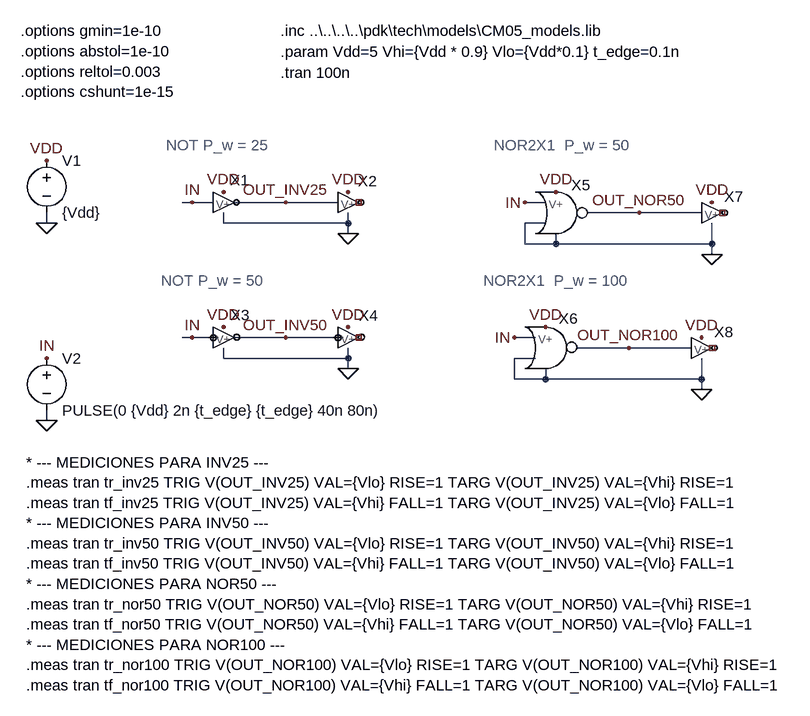
[diagram p0: schematic INFRA_tb.asc]
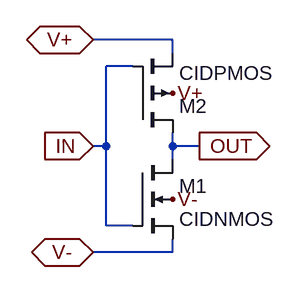
[diagram p1: sub-circuit not.asc]
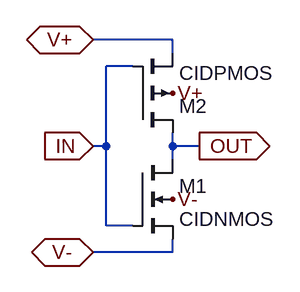
[diagram p2: sub-circuit not_wp_50.asc]
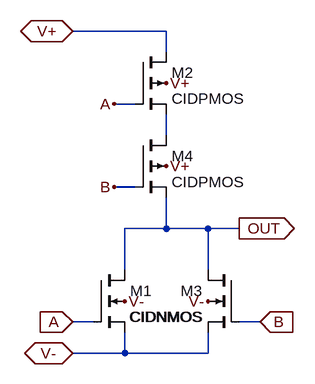
[diagram p3: sub-circuit nor2x1.asc]
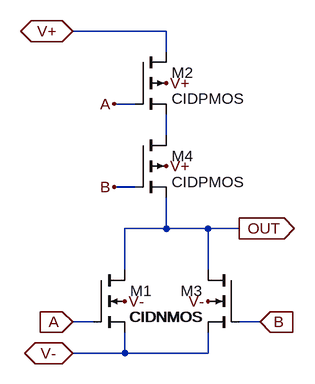
[diagram p4: sub-circuit nor2x1_wp_100.asc]
INFRA_tb.asc, the LTspice schematic file:
Version 4.1
SHEET 1 1208 956
WIRE -48 128 -64 128
WIRE -16 128 -48 128
WIRE 96 128 16 128
WIRE 176 128 96 128
WIRE 496 128 464 128
WIRE 640 144 560 144
WIRE 736 144 640 144
WIRE -272 160 -272 144
WIRE 0 160 0 144
WIRE 192 160 192 144
WIRE 192 160 0 160
WIRE 496 160 464 160
WIRE 192 176 192 160
WIRE 464 192 464 160
WIRE 512 192 512 176
WIRE 512 192 464 192
WIRE 752 192 752 160
WIRE 752 192 512 192
WIRE 752 208 752 192
WIRE -48 336 -64 336
WIRE -16 336 -48 336
WIRE 96 336 16 336
WIRE 176 336 96 336
WIRE 480 336 448 336
WIRE 624 352 544 352
WIRE 720 352 624 352
WIRE 0 368 0 352
WIRE 192 368 192 352
WIRE 192 368 0 368
WIRE 480 368 448 368
WIRE 192 384 192 368
WIRE 448 400 448 368
WIRE 496 400 496 384
WIRE 496 400 448 400
WIRE 736 400 736 368
WIRE 736 400 496 400
WIRE 736 416 736 400
WIRE -272 464 -272 448
FLAG 752 208 0
FLAG 736 416 0
FLAG 192 384 0
FLAG 192 176 0
FLAG 96 128 OUT_INV25
FLAG 96 336 OUT_INV50
FLAG 624 352 OUT_NOR100
FLAG 640 144 OUT_NOR50
FLAG -48 128 IN
FLAG -48 336 IN
FLAG 464 128 IN
FLAG 448 336 IN
FLAG 192 320 VDD
FLAG 0 320 VDD
FLAG 0 112 VDD
FLAG 192 112 VDD
FLAG 512 112 VDD
FLAG 752 128 VDD
FLAG 736 336 VDD
FLAG 496 320 VDD
FLAG -272 64 VDD
FLAG -272 368 IN
FLAG -272 464 0
FLAG -272 160 0
SYMBOL NOT -16 128 R0
WINDOW 0 41 -19 Bottom 2
SYMATTR InstName X1
SYMBOL NOT 176 128 R0
WINDOW 0 46 -17 Bottom 2
SYMATTR InstName X2
SYMBOL NOT_Wp_50 16 368 R0
WINDOW 0 10 -51 Bottom 2
SYMATTR InstName X3
SYMBOL NOT_Wp_50 208 368 R0
WINDOW 0 15 -50 Bottom 2
SYMATTR InstName X4
SYMBOL NOR2X1 512 144 R0
SYMATTR InstName X5
SYMBOL NOR2X1_Wp_100 496 352 R0
WINDOW 0 35 -30 Bottom 2
SYMATTR InstName X6
SYMBOL voltage -272 48 R0
SYMATTR InstName V1
SYMATTR Value {Vdd}
SYMBOL voltage -272 352 R0
SYMATTR InstName V2
SYMATTR Value PULSE(0 {Vdd} 2n {t_edge} {t_edge} 40n 80n)
SYMBOL NOT 736 144 R0
SYMATTR InstName X7
SYMBOL NOT 720 352 R0
SYMATTR InstName X8
TEXT -312 -136 Left 2 !.options gmin=1e-10\n.options abstol=1e-10\n.options reltol=0.003\n.options cshunt=1e-15
TEXT 88 -136 Left 2 !.inc ..\\..\\..\\..\\pdk\\tech\\models\\CM05_models.lib
TEXT -88 40 Left 2 ;NOT P_w = 25
TEXT -96 248 Left 2 ;NOT P_w = 50
TEXT 416 40 Left 2 ;NOR2X1  P_w = 50
TEXT 400 248 Left 2 ;NOR2X1  P_w = 100
TEXT 88 -72 Left 2 !.tran 100n
TEXT 88 -104 Left 2 !.param Vdd=5 Vhi={Vdd * 0.9} Vlo={Vdd*0.1} t_edge=0.1n
TEXT -304 528 Left 2 !* --- MEDICIONES PARA INV25 ---\n.meas tran tr_inv25 TRIG V(OUT_INV25) VAL={Vlo} RISE=1 TARG V(OUT_INV25) VAL={Vhi} RISE=1\n.meas tran tf_inv25 TRIG V(OUT_INV25) VAL={Vhi} FALL=1 TARG V(OUT_INV25) VAL={Vlo} FALL=1\n* --- MEDICIONES PARA INV50 ---\n.meas tran tr_inv50 TRIG V(OUT_INV50) VAL={Vlo} RISE=1 TARG V(OUT_INV50) VAL={Vhi} RISE=1\n.meas tran tf_inv50 TRIG V(OUT_INV50) VAL={Vhi} FALL=1 TARG V(OUT_INV50) VAL={Vlo} FALL=1\n* --- MEDICIONES PARA NOR50 ---\n.meas tran tr_nor50 TRIG V(OUT_NOR50) VAL={Vlo} RISE=1 TARG V(OUT_NOR50) VAL={Vhi} RISE=1\n.meas tran tf_nor50 TRIG V(OUT_NOR50) VAL={Vhi} FALL=1 TARG V(OUT_NOR50) VAL={Vlo} FALL=1\n* --- MEDICIONES PARA NOR100 ---\n.meas tran tr_nor100 TRIG V(OUT_NOR100) VAL={Vlo} RISE=1 TARG V(OUT_NOR100) VAL={Vhi} RISE=1\n.meas tran tf_nor100 TRIG V(OUT_NOR100) VAL={Vhi} FALL=1 TARG V(OUT_NOR100) VAL={Vlo} FALL=1

not.asc, the sub-circuit schematic file:
Version 4.1
SHEET 1 880 680
WIRE 256 16 160 16
WIRE 256 32 256 16
WIRE 208 48 176 48
WIRE 176 144 176 48
WIRE 176 144 160 144
WIRE 256 144 256 128
WIRE 288 144 256 144
WIRE 256 160 256 144
WIRE 176 240 176 144
WIRE 208 240 176 240
WIRE 256 272 256 256
WIRE 256 272 160 272
FLAG 160 144 IN
IOPIN 160 144 In
FLAG 288 144 OUT
IOPIN 288 144 Out
FLAG 160 272 V-
IOPIN 160 272 BiDir
FLAG 256 208 V-
FLAG 160 16 V+
IOPIN 160 16 BiDir
FLAG 256 80 V+
SYMBOL nmos4 208 160 R0
SYMATTR InstName M1
SYMATTR Value CIDNMOS
SYMATTR Value2 l=5u w=10u
SYMBOL pmos4 208 128 M180
SYMATTR InstName M2
SYMATTR Value CIDPMOS
SYMATTR Value2 l=5u w=25u

not_wp_50.asc, the sub-circuit schematic file:
Version 4.1
SHEET 1 880 680
WIRE 256 16 160 16
WIRE 256 32 256 16
WIRE 208 48 176 48
WIRE 176 144 176 48
WIRE 176 144 160 144
WIRE 256 144 256 128
WIRE 288 144 256 144
WIRE 256 160 256 144
WIRE 176 240 176 144
WIRE 208 240 176 240
WIRE 256 272 256 256
WIRE 256 272 160 272
FLAG 160 144 IN
IOPIN 160 144 In
FLAG 288 144 OUT
IOPIN 288 144 Out
FLAG 160 272 V-
IOPIN 160 272 BiDir
FLAG 256 208 V-
FLAG 160 16 V+
IOPIN 160 16 BiDir
FLAG 256 80 V+
SYMBOL nmos4 208 160 R0
SYMATTR InstName M1
SYMATTR Value CIDNMOS
SYMATTR Value2 l=5u w=10u
SYMBOL pmos4 208 128 M180
SYMATTR InstName M2
SYMATTR Value CIDPMOS
SYMATTR Value2 l=5u w=50u

nor2x1.asc, the sub-circuit schematic file:
Version 4.1
SHEET 1 880 680
WIRE 192 -160 48 -160
WIRE 192 -128 192 -160
WIRE 144 -48 112 -48
WIRE 192 0 192 -32
WIRE 144 80 112 80
WIRE 192 144 192 96
WIRE 192 144 128 144
WIRE 256 144 192 144
WIRE 304 144 256 144
WIRE 128 208 128 144
WIRE 256 208 256 144
WIRE 80 288 48 288
WIRE 336 288 304 288
WIRE 128 336 128 304
WIRE 128 336 48 336
WIRE 256 336 256 304
WIRE 256 336 128 336
FLAG 48 288 A
IOPIN 48 288 In
FLAG 336 288 B
IOPIN 336 288 In
FLAG 304 144 OUT
IOPIN 304 144 Out
FLAG 112 -48 A
FLAG 112 80 B
FLAG 48 -160 V+
IOPIN 48 -160 BiDir
FLAG 256 256 V-
FLAG 128 256 V-
FLAG 192 -80 V+
FLAG 192 48 V+
FLAG 48 336 V-
IOPIN 48 336 BiDir
SYMBOL nmos4 80 208 R0
SYMATTR InstName M1
SYMATTR Value CIDNMOS
SYMATTR Value2 l=5u w=10u
SYMBOL pmos4 144 -128 R0
SYMATTR InstName M2
SYMATTR Value CIDPMOS
SYMATTR Value2 l=5u w=25u
SYMBOL nmos4 304 208 M0
SYMATTR InstName M3
SYMATTR Value CIDNMOS
SYMATTR Value2 l=5u w=10u
SYMBOL pmos4 144 0 R0
SYMATTR InstName M4
SYMATTR Value CIDPMOS
SYMATTR Value2 l=5u w=25u

nor2x1_wp_100.asc, the sub-circuit schematic file:
Version 4.1
SHEET 1 880 680
WIRE 192 -160 48 -160
WIRE 192 -128 192 -160
WIRE 144 -48 112 -48
WIRE 192 0 192 -32
WIRE 144 80 112 80
WIRE 192 144 192 96
WIRE 192 144 128 144
WIRE 256 144 192 144
WIRE 304 144 256 144
WIRE 128 208 128 144
WIRE 256 208 256 144
WIRE 80 288 48 288
WIRE 336 288 304 288
WIRE 128 336 128 304
WIRE 128 336 48 336
WIRE 256 336 256 304
WIRE 256 336 128 336
FLAG 48 288 A
IOPIN 48 288 In
FLAG 336 288 B
IOPIN 336 288 In
FLAG 304 144 OUT
IOPIN 304 144 Out
FLAG 112 -48 A
FLAG 112 80 B
FLAG 48 -160 V+
IOPIN 48 -160 BiDir
FLAG 256 256 V-
FLAG 128 256 V-
FLAG 192 -80 V+
FLAG 192 48 V+
FLAG 48 336 V-
IOPIN 48 336 BiDir
SYMBOL nmos4 80 208 R0
SYMATTR InstName M1
SYMATTR Value CIDNMOS
SYMATTR Value2 l=5u w=10u
SYMBOL pmos4 144 -128 R0
SYMATTR InstName M2
SYMATTR Value CIDPMOS
SYMATTR Value2 l=5u w=100u
SYMBOL nmos4 304 208 M0
SYMATTR InstName M3
SYMATTR Value CIDNMOS
SYMATTR Value2 l=5u w=10u
SYMBOL pmos4 144 0 R0
SYMATTR InstName M4
SYMATTR Value CIDPMOS
SYMATTR Value2 l=5u w=100u

The netlist it stands for:
* INFRA_tb.asc
X§X1 IN OUT_INV25 VDD 0 not
X§X2 OUT_INV25 NC_01 VDD 0 not
X§X3 IN OUT_INV50 VDD 0 not_wp_50
X§X4 OUT_INV50 NC_02 VDD 0 not_wp_50
X§X5 IN 0 OUT_NOR50 VDD 0 nor2x1
X§X6 IN 0 OUT_NOR100 VDD 0 nor2x1_wp_100
V1 VDD 0 {Vdd}
V2 IN 0 PULSE(0 {Vdd} 2n {t_edge} {t_edge} 40n 80n)
X§X7 OUT_NOR50 NC_03 VDD 0 not
X§X8 OUT_NOR100 NC_04 VDD 0 not

* block symbol definitions
.subckt not IN OUT V+ V-
M1 OUT IN V- V- CIDNMOS l=5u w=10u
M2 OUT IN V+ V+ CIDPMOS l=5u w=25u
.ends not

.subckt not_wp_50 IN OUT V+ V-
M1 OUT IN V- V- CIDNMOS l=5u w=10u
M2 OUT IN V+ V+ CIDPMOS l=5u w=50u
.ends not_wp_50

.subckt nor2x1 A B OUT V+ V-
M1 OUT A V- V- CIDNMOS l=5u w=10u
M2 V+ A N001 V+ CIDPMOS l=5u w=25u
M3 OUT B V- V- CIDNMOS l=5u w=10u
M4 N001 B OUT V+ CIDPMOS l=5u w=25u
.ends nor2x1

.subckt nor2x1_wp_100 A B OUT V+ V-
M1 OUT A V- V- CIDNMOS l=5u w=10u
M2 V+ A N001 V+ CIDPMOS l=5u w=100u
M3 OUT B V- V- CIDNMOS l=5u w=10u
M4 N001 B OUT V+ CIDPMOS l=5u w=100u
.ends nor2x1_wp_100

.model NMOS NMOS
.model PMOS PMOS
.lib standard.mos
.options gmin=1e-10
.options abstol=1e-10
.options reltol=0.003
.options cshunt=1e-15
.inc ..\..\..\..\pdk\tech\models\CM05_models.lib
* NOT P_w = 25
* NOT P_w = 50
* NOR2X1  P_w = 50
* NOR2X1  P_w = 100
.tran 100n
.param Vdd=5 Vhi={Vdd * 0.9} Vlo={Vdd*0.1} t_edge=0.1n
* --- MEDICIONES PARA INV25 ---
.meas tran tr_inv25 TRIG V(OUT_INV25) VAL={Vlo} RISE=1 TARG V(OUT_INV25) VAL={Vhi} RISE=1
.meas tran tf_inv25 TRIG V(OUT_INV25) VAL={Vhi} FALL=1 TARG V(OUT_INV25) VAL={Vlo} FALL=1
* --- MEDICIONES PARA INV50 ---
.meas tran tr_inv50 TRIG V(OUT_INV50) VAL={Vlo} RISE=1 TARG V(OUT_INV50) VAL={Vhi} RISE=1
.meas tran tf_inv50 TRIG V(OUT_INV50) VAL={Vhi} FALL=1 TARG V(OUT_INV50) VAL={Vlo} FALL=1
* --- MEDICIONES PARA NOR50 ---
.meas tran tr_nor50 TRIG V(OUT_NOR50) VAL={Vlo} RISE=1 TARG V(OUT_NOR50) VAL={Vhi} RISE=1
.meas tran tf_nor50 TRIG V(OUT_NOR50) VAL={Vhi} FALL=1 TARG V(OUT_NOR50) VAL={Vlo} FALL=1
* --- MEDICIONES PARA NOR100 ---
.meas tran tr_nor100 TRIG V(OUT_NOR100) VAL={Vlo} RISE=1 TARG V(OUT_NOR100) VAL={Vhi} RISE=1
.meas tran tf_nor100 TRIG V(OUT_NOR100) VAL={Vhi} FALL=1 TARG V(OUT_NOR100) VAL={Vlo} FALL=1
.backanno
.end